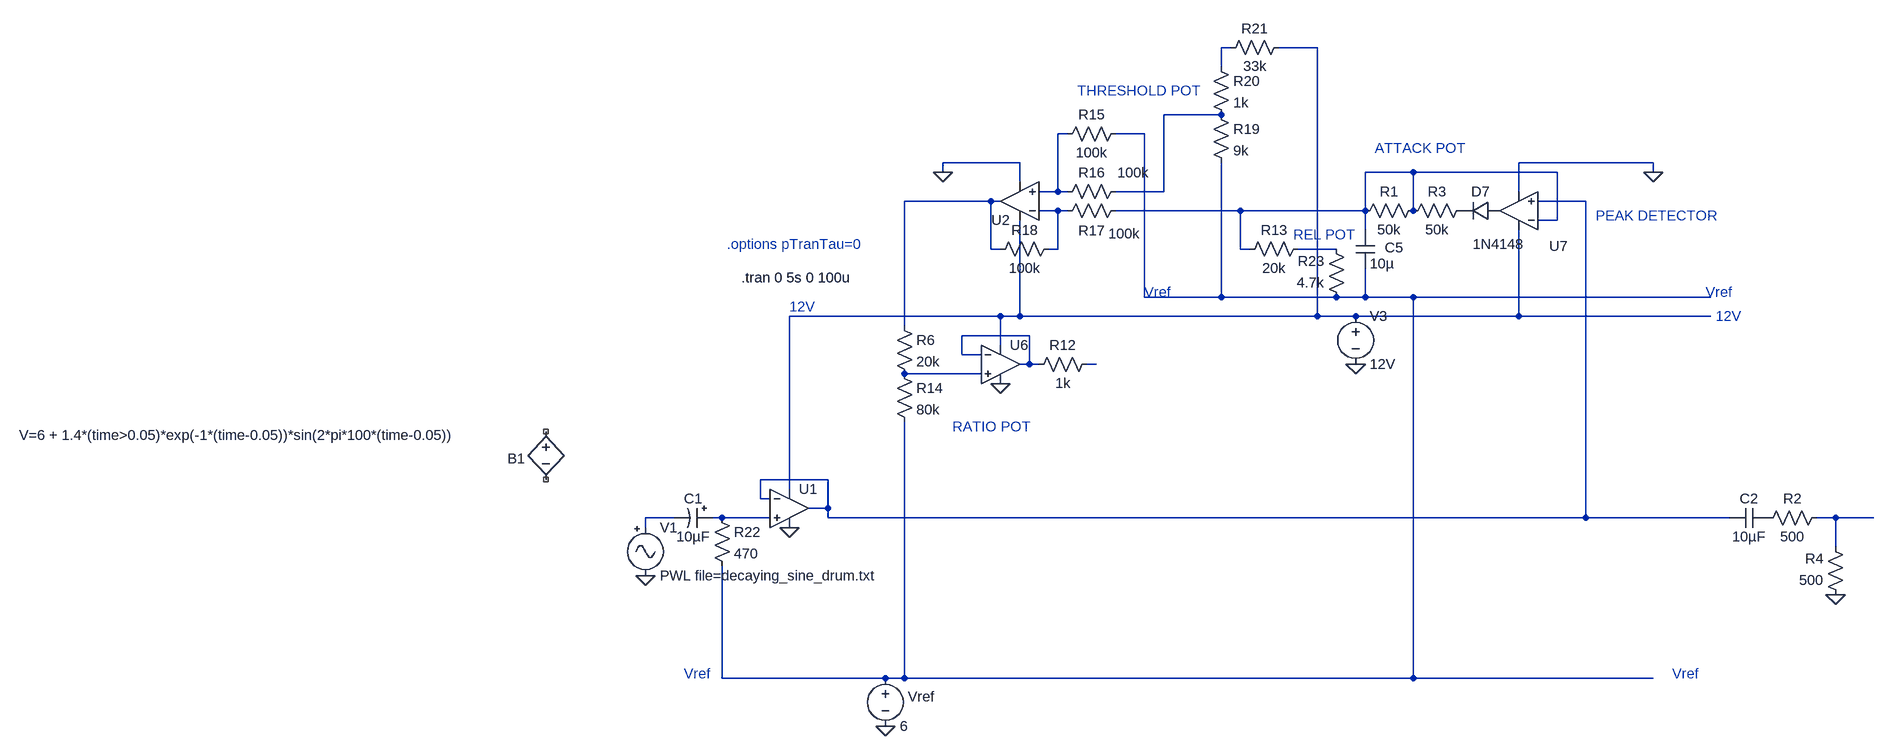
[diagram p0: schematic FM_DRUMMACHINE_COMPRESSOR_PEAKDETECTOR.asc]
FM_DRUMMACHINE_COMPRESSOR_PEAKDETECTOR.asc, the LTspice schematic file:
Version 4.1
SHEET 1 1828 1408
WIRE 656 48 640 48
WIRE 800 48 736 48
WIRE 640 80 640 48
WIRE 640 160 544 160
WIRE 384 192 368 192
WIRE 512 192 464 192
WIRE 304 240 176 240
WIRE 1360 240 1136 240
WIRE 176 256 176 240
WIRE 960 256 880 256
WIRE 1200 256 960 256
WIRE 1360 256 1360 240
WIRE 304 272 304 240
WIRE 368 288 368 192
WIRE 368 288 336 288
WIRE 384 288 368 288
WIRE 544 288 544 160
WIRE 544 288 464 288
WIRE 1136 288 1136 240
WIRE 256 304 112 304
WIRE 272 304 256 304
WIRE 1248 304 1168 304
WIRE 368 320 336 320
WIRE 384 320 368 320
WIRE 672 320 464 320
WIRE 880 320 880 256
WIRE 880 320 672 320
WIRE 960 320 960 256
WIRE 1200 336 1200 256
WIRE 1200 336 1168 336
WIRE 880 352 880 320
WIRE 256 384 256 304
WIRE 272 384 256 384
WIRE 368 384 368 320
WIRE 368 384 352 384
WIRE 672 384 672 320
WIRE 688 384 672 384
WIRE 832 384 768 384
WIRE 512 464 512 192
WIRE 640 464 640 240
WIRE 640 464 512 464
WIRE 832 464 640 464
WIRE 880 464 880 416
WIRE 880 464 832 464
WIRE 960 464 880 464
WIRE 1456 464 960 464
WIRE 272 496 -80 496
WIRE 304 496 304 336
WIRE 304 496 272 496
WIRE 800 496 800 48
WIRE 800 496 304 496
WIRE 864 496 800 496
WIRE 1136 496 1136 352
WIRE 1136 496 864 496
WIRE 1456 496 1136 496
WIRE 112 512 112 304
WIRE 320 528 208 528
WIRE 272 544 272 496
WIRE 208 560 208 528
WIRE 240 560 208 560
WIRE 320 576 320 528
WIRE 320 576 304 576
WIRE 336 576 320 576
WIRE 432 576 416 576
WIRE 240 592 112 592
WIRE -16 768 -128 768
WIRE -80 784 -80 496
WIRE -128 800 -128 768
WIRE -112 800 -128 800
WIRE -16 816 -16 768
WIRE -16 816 -48 816
WIRE -272 832 -320 832
WIRE -192 832 -208 832
WIRE -112 832 -192 832
WIRE -16 832 -16 816
WIRE 1248 832 1248 304
WIRE 1248 832 -16 832
WIRE 1488 832 1248 832
WIRE 1664 832 1632 832
WIRE 1728 832 1664 832
WIRE -320 848 -320 832
WIRE 1664 880 1664 832
WIRE -192 1216 -192 912
WIRE 80 1216 -192 1216
WIRE 112 1216 112 672
WIRE 112 1216 80 1216
WIRE 960 1216 960 464
WIRE 960 1216 112 1216
WIRE 1360 1216 960 1216
FLAG 272 608 0
FLAG 1360 256 0
FLAG 864 576 0
FLAG 80 1296 0
FLAG -80 848 0
FLAG -320 928 0
FLAG 176 256 0
FLAG 1664 960 0
SYMBOL OpAmps\\UniversalOpAmp 272 576 R0
SYMATTR InstName U6
SYMBOL res 432 560 R90
WINDOW 0 0 56 VBottom 2
WINDOW 3 32 56 VTop 2
SYMATTR InstName R12
SYMATTR Value 1k
SYMBOL OpAmps\\UniversalOpAmp 1136 320 R180
WINDOW 0 -82 -59 Left 2
SYMATTR InstName U7
SYMBOL diode 1104 304 R90
WINDOW 0 0 32 VBottom 2
WINDOW 3 56 2 VTop 2
SYMATTR InstName D7
SYMATTR Value 1N4148
SYMBOL cap 864 352 R0
WINDOW 0 49 30 Left 2
SYMATTR InstName C5
SYMATTR Value 10µ
SYMATTR SpiceLine V=16 Irms=0 Rser=0.0038 Lser=877p mfg="Würth Elektronik" pn="885012108017 WCAP-CSGP 1206" type="X5R"
SYMBOL res 784 368 R90
WINDOW 0 0 56 VBottom 2
WINDOW 3 32 56 VTop 2
SYMATTR InstName R13
SYMATTR Value 20k
SYMBOL voltage 864 480 R0
WINDOW 123 0 0 Left 0
WINDOW 39 0 0 Left 0
SYMATTR InstName V3
SYMATTR Value 12V
SYMBOL voltage 80 1200 R0
WINDOW 123 0 0 Left 0
WINDOW 39 0 0 Left 0
WINDOW 0 38 47 Left 2
SYMATTR InstName Vref
SYMATTR Value 6
SYMBOL bv -816 672 R0
WINDOW 3 -878 22 Left 2
WINDOW 0 -64 61 Left 2
SYMATTR Value V=6 + 1.4*(time>0.05)*exp(-1*(time-0.05))*sin(2*pi*100*(time-0.05))
SYMATTR InstName B1
SYMBOL OpAmps\\UniversalOpAmp -80 816 R0
SYMATTR InstName U1
SYMBOL res 1056 304 R90
WINDOW 0 0 56 VBottom 2
WINDOW 3 32 56 VTop 2
SYMATTR InstName R3
SYMATTR Value 50k
SYMBOL res 96 496 R0
SYMATTR InstName R6
SYMATTR Value 20k
SYMBOL res 96 576 R0
SYMATTR InstName R14
SYMATTR Value 80k
SYMBOL OpAmps\\UniversalOpAmp 304 304 R180
SYMATTR InstName U2
SYMBOL res 368 208 R270
WINDOW 0 32 56 VTop 2
WINDOW 3 0 56 VBottom 2
SYMATTR InstName R15
SYMATTR Value 100k
SYMBOL res 480 272 R90
WINDOW 0 0 56 VBottom 2
WINDOW 3 -31 -13 VTop 2
SYMATTR InstName R16
SYMATTR Value 100k
SYMBOL res 480 304 R90
WINDOW 0 65 56 VBottom 2
WINDOW 3 39 2 VTop 2
SYMATTR InstName R17
SYMATTR Value 100k
SYMBOL res 256 400 R270
WINDOW 0 32 56 VTop 2
WINDOW 3 0 56 VBottom 2
SYMATTR InstName R18
SYMATTR Value 100k
SYMBOL res 624 144 R0
SYMATTR InstName R19
SYMATTR Value 9k
SYMBOL res 624 64 R0
SYMATTR InstName R20
SYMATTR Value 1k
SYMBOL res 752 32 R90
WINDOW 0 0 56 VBottom 2
WINDOW 3 32 56 VTop 2
SYMATTR InstName R21
SYMATTR Value 33k
SYMBOL Misc\\signal -320 832 R0
WINDOW 123 0 0 Left 0
WINDOW 39 0 0 Left 0
SYMATTR InstName V1
SYMATTR Value PWL file=decaying_sine_drum.txt
SYMBOL Misc\\EuropeanPolcap -208 816 R90
WINDOW 0 0 32 VBottom 2
WINDOW 3 32 32 VTop 2
SYMATTR InstName C1
SYMATTR Value 10µF
SYMBOL res -208 816 R0
SYMATTR InstName R22
SYMATTR Value 470
SYMBOL res 848 480 R180
WINDOW 0 36 76 Left 2
WINDOW 3 36 40 Left 2
SYMATTR InstName R23
SYMATTR Value 4.7k
SYMBOL res 976 304 R90
WINDOW 0 0 56 VBottom 2
WINDOW 3 32 56 VTop 2
SYMATTR InstName R1
SYMATTR Value 50k
SYMBOL cap 1552 816 R90
WINDOW 0 0 32 VBottom 2
WINDOW 3 32 32 VTop 2
SYMATTR InstName C2
SYMATTR Value 10µF
SYMBOL res 1648 816 R90
WINDOW 0 0 56 VBottom 2
WINDOW 3 32 56 VTop 2
SYMATTR InstName R2
SYMATTR Value 500
SYMBOL res 1680 976 R180
WINDOW 0 36 76 Left 2
WINDOW 3 36 40 Left 2
SYMATTR InstName R4
SYMATTR Value 500
TEXT -160 432 Left 2 !.tran 0 5s 0 100u
TEXT 1392 1208 Left 2 ;Vref
TEXT 512 456 Left 2 ;Vref
TEXT 1464 496 Left 2 ;12V
TEXT 400 120 Left 2 ;THRESHOLD POT
TEXT -184 376 Left 2 ;.options pTranTau=0
TEXT 1264 328 Left 2 ;PEAK DETECTOR
TEXT 896 216 Left 2 ;ATTACK POT
TEXT 192 680 Left 2 ;RATIO POT
TEXT 760 360 Left 2 ;REL POT
TEXT 1448 456 Left 2 ;Vref
TEXT -80 480 Left 2 ;12V
TEXT -256 1208 Left 2 ;Vref

The netlist it stands for:
* FM_DRUMMACHINE_COMPRESSOR_PEAKDETECTOR.asc
X§U6 N013 N011 N002 0 N011 level1 Avol=1Meg GBW=10Meg Vos=0 En=0 Enk=0 In=0 Ink=0 Rin=500Meg  ; pins In+ In- V+ V- OUT
R12 N012 N011 1k
X§U7 N008 N006 N002 0 P001 level1 Avol=1Meg GBW=10Meg Vos=0 En=0 Enk=0 In=0 Ink=0 Rin=500Meg  ; pins In+ In- V+ V- OUT
D7 P001 P002 1N4148
C5 N006 N005 10µ V=16 Irms=0 Rser=0.0038 Lser=877p mfg="Würth Elektronik" pn="885012108017 WCAP-CSGP 1206" type="X5R"
R13 N010 N006 20k
V3 N002 0 12V
Vref N005 0 6
B1 NC_01 NC_02 V=6 + 1.4*(time>0.05)*exp(-1*(time-0.05))*sin(2*pi*100*(time-0.05))
X§U1 N015 N008 N002 0 N008 level1 Avol=1Meg GBW=10Meg Vos=0 En=0 Enk=0 In=0 Ink=0 Rin=500Meg  ; pins In+ In- V+ V- OUT
R3 P002 N006 50k
R6 N007 N013 20k
R14 N013 N005 80k
X§U2 N004 N009 N002 0 N007 level1 Avol=1Meg GBW=10Meg Vos=0 En=0 Enk=0 In=0 Ink=0 Rin=500Meg  ; pins In+ In- V+ V- OUT
R15 N004 N005 100k
R16 N003 N004 100k
R17 N006 N009 100k
R18 N007 N009 100k
R19 N003 N005 9k
R20 N001 N003 1k
R21 N002 N001 33k
V1 N014 0 PWL file=decaying_sine_drum.txt
C1 N015 N014 10µF
R22 N015 N005 470
R23 N005 N010 4.7k
R1 N006 N006 50k
C2 P003 N008 10µF
R2 N016 P003 500
R4 0 N016 500
.model D D
.lib standard.dio
.tran 0 5s 0 100u
* Vref
* Vref
* 12V
* THRESHOLD POT
* .options pTranTau=0
* PEAK DETECTOR
* ATTACK POT
* RATIO POT
* REL POT
* Vref
* 12V
* Vref
.lib UniversalOpAmp1.lib
.backanno
.end